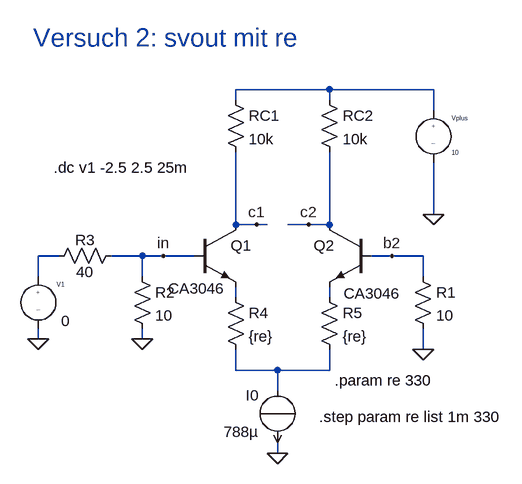
[diagram p0: schematic diff_a2.asc]
diff_a2.asc, the LTspice schematic file:
Version 4
SHEET 1 952 680
WIRE 448 -96 304 -96
WIRE 608 -96 448 -96
WIRE 304 -80 304 -96
WIRE 448 -80 448 -96
WIRE 608 -64 608 -96
WIRE 608 96 608 16
WIRE 304 112 304 0
WIRE 336 112 304 112
WIRE 352 112 336 112
WIRE 416 112 384 112
WIRE 448 112 448 0
WIRE 448 112 416 112
WIRE 32 160 0 160
WIRE 160 160 112 160
WIRE 192 160 160 160
WIRE 240 160 192 160
WIRE 544 160 512 160
WIRE 592 160 544 160
WIRE 0 192 0 160
WIRE 160 192 160 160
WIRE 592 192 592 160
WIRE 304 224 304 208
WIRE 448 224 448 208
WIRE 0 288 0 272
WIRE 160 288 160 272
WIRE 592 304 592 272
WIRE 304 336 304 304
WIRE 368 336 304 336
WIRE 448 336 448 304
WIRE 448 336 368 336
WIRE 368 368 368 336
WIRE 368 464 368 448
FLAG 368 464 0
FLAG 592 304 0
FLAG 160 288 0
FLAG 0 288 0
FLAG 608 96 0
FLAG 336 112 c1
FLAG 416 112 c2
FLAG 192 160 in
FLAG 544 160 b2
SYMBOL EIT_Semiconductors\\npn 240 112 R0
WINDOW 3 -40 98 Left 2
SYMATTR Value CA3046
SYMATTR InstName Q1
SYMBOL EIT_Semiconductors\\npn 512 112 M0
WINDOW 3 -45 106 Left 2
SYMATTR Value CA3046
SYMATTR InstName Q2
SYMBOL source-I 368 448 R180
WINDOW 0 29 73 Left 2
WINDOW 3 29 17 Left 2
SYMATTR InstName I0
SYMATTR Value 788µ
SYMBOL res 288 -96 R0
SYMATTR InstName RC1
SYMATTR Value 10k
SYMBOL res 432 -96 R0
SYMATTR InstName RC2
SYMATTR Value 10k
SYMBOL res 576 176 R0
SYMATTR InstName R1
SYMATTR Value 10
SYMBOL res 144 176 R0
SYMATTR InstName R2
SYMATTR Value 10
SYMBOL res 16 176 R270
WINDOW 0 25 56 VTop 2
WINDOW 3 7 56 VBottom 2
SYMATTR InstName R3
SYMATTR Value 40
SYMBOL source-V 0 176 R0
WINDOW 3 35 84 Left 2
WINDOW 123 0 0 Left 2
WINDOW 39 0 0 Left 2
SYMATTR Value 0
SYMATTR InstName V1
SYMBOL source-V 608 -80 R0
SYMATTR InstName Vplus
SYMATTR Value 10
SYMBOL res 288 208 R0
SYMATTR InstName R4
SYMATTR Value {re}
SYMBOL res 432 208 R0
SYMATTR InstName R5
SYMATTR Value {re}
TEXT 24 24 Left 2 !.dc v1 -2.5 2.5 25m
TEXT -8 -176 Left 4 ;Versuch 2: svout mit re
TEXT 456 352 Left 2 !.param re 330
TEXT 432 408 Left 2 !.step param re list 1m 330

The netlist it stands for:
* diff_a2.asc
Q1 c1 in N003 0 CA3046
Q2 c2 b2 N004 0 CA3046
I0 N005 0 788µ
RC1 N001 c1 10k
RC2 N001 c2 10k
R1 b2 0 10
R2 in 0 10
R3 N002 in 40
V1 N002 0 0
Vplus N001 0 10
R4 N003 N005 {re}
R5 N004 N005 {re}
.model NPN NPN
.model PNP PNP
.lib standard.bjt
.dc v1 -2.5 2.5 25m
* Versuch 2: svout mit re
.param re 330
.step param re list 1m 330
.backanno
.end